# EAGLE design SD_Node (EAGLE 7.2.0)
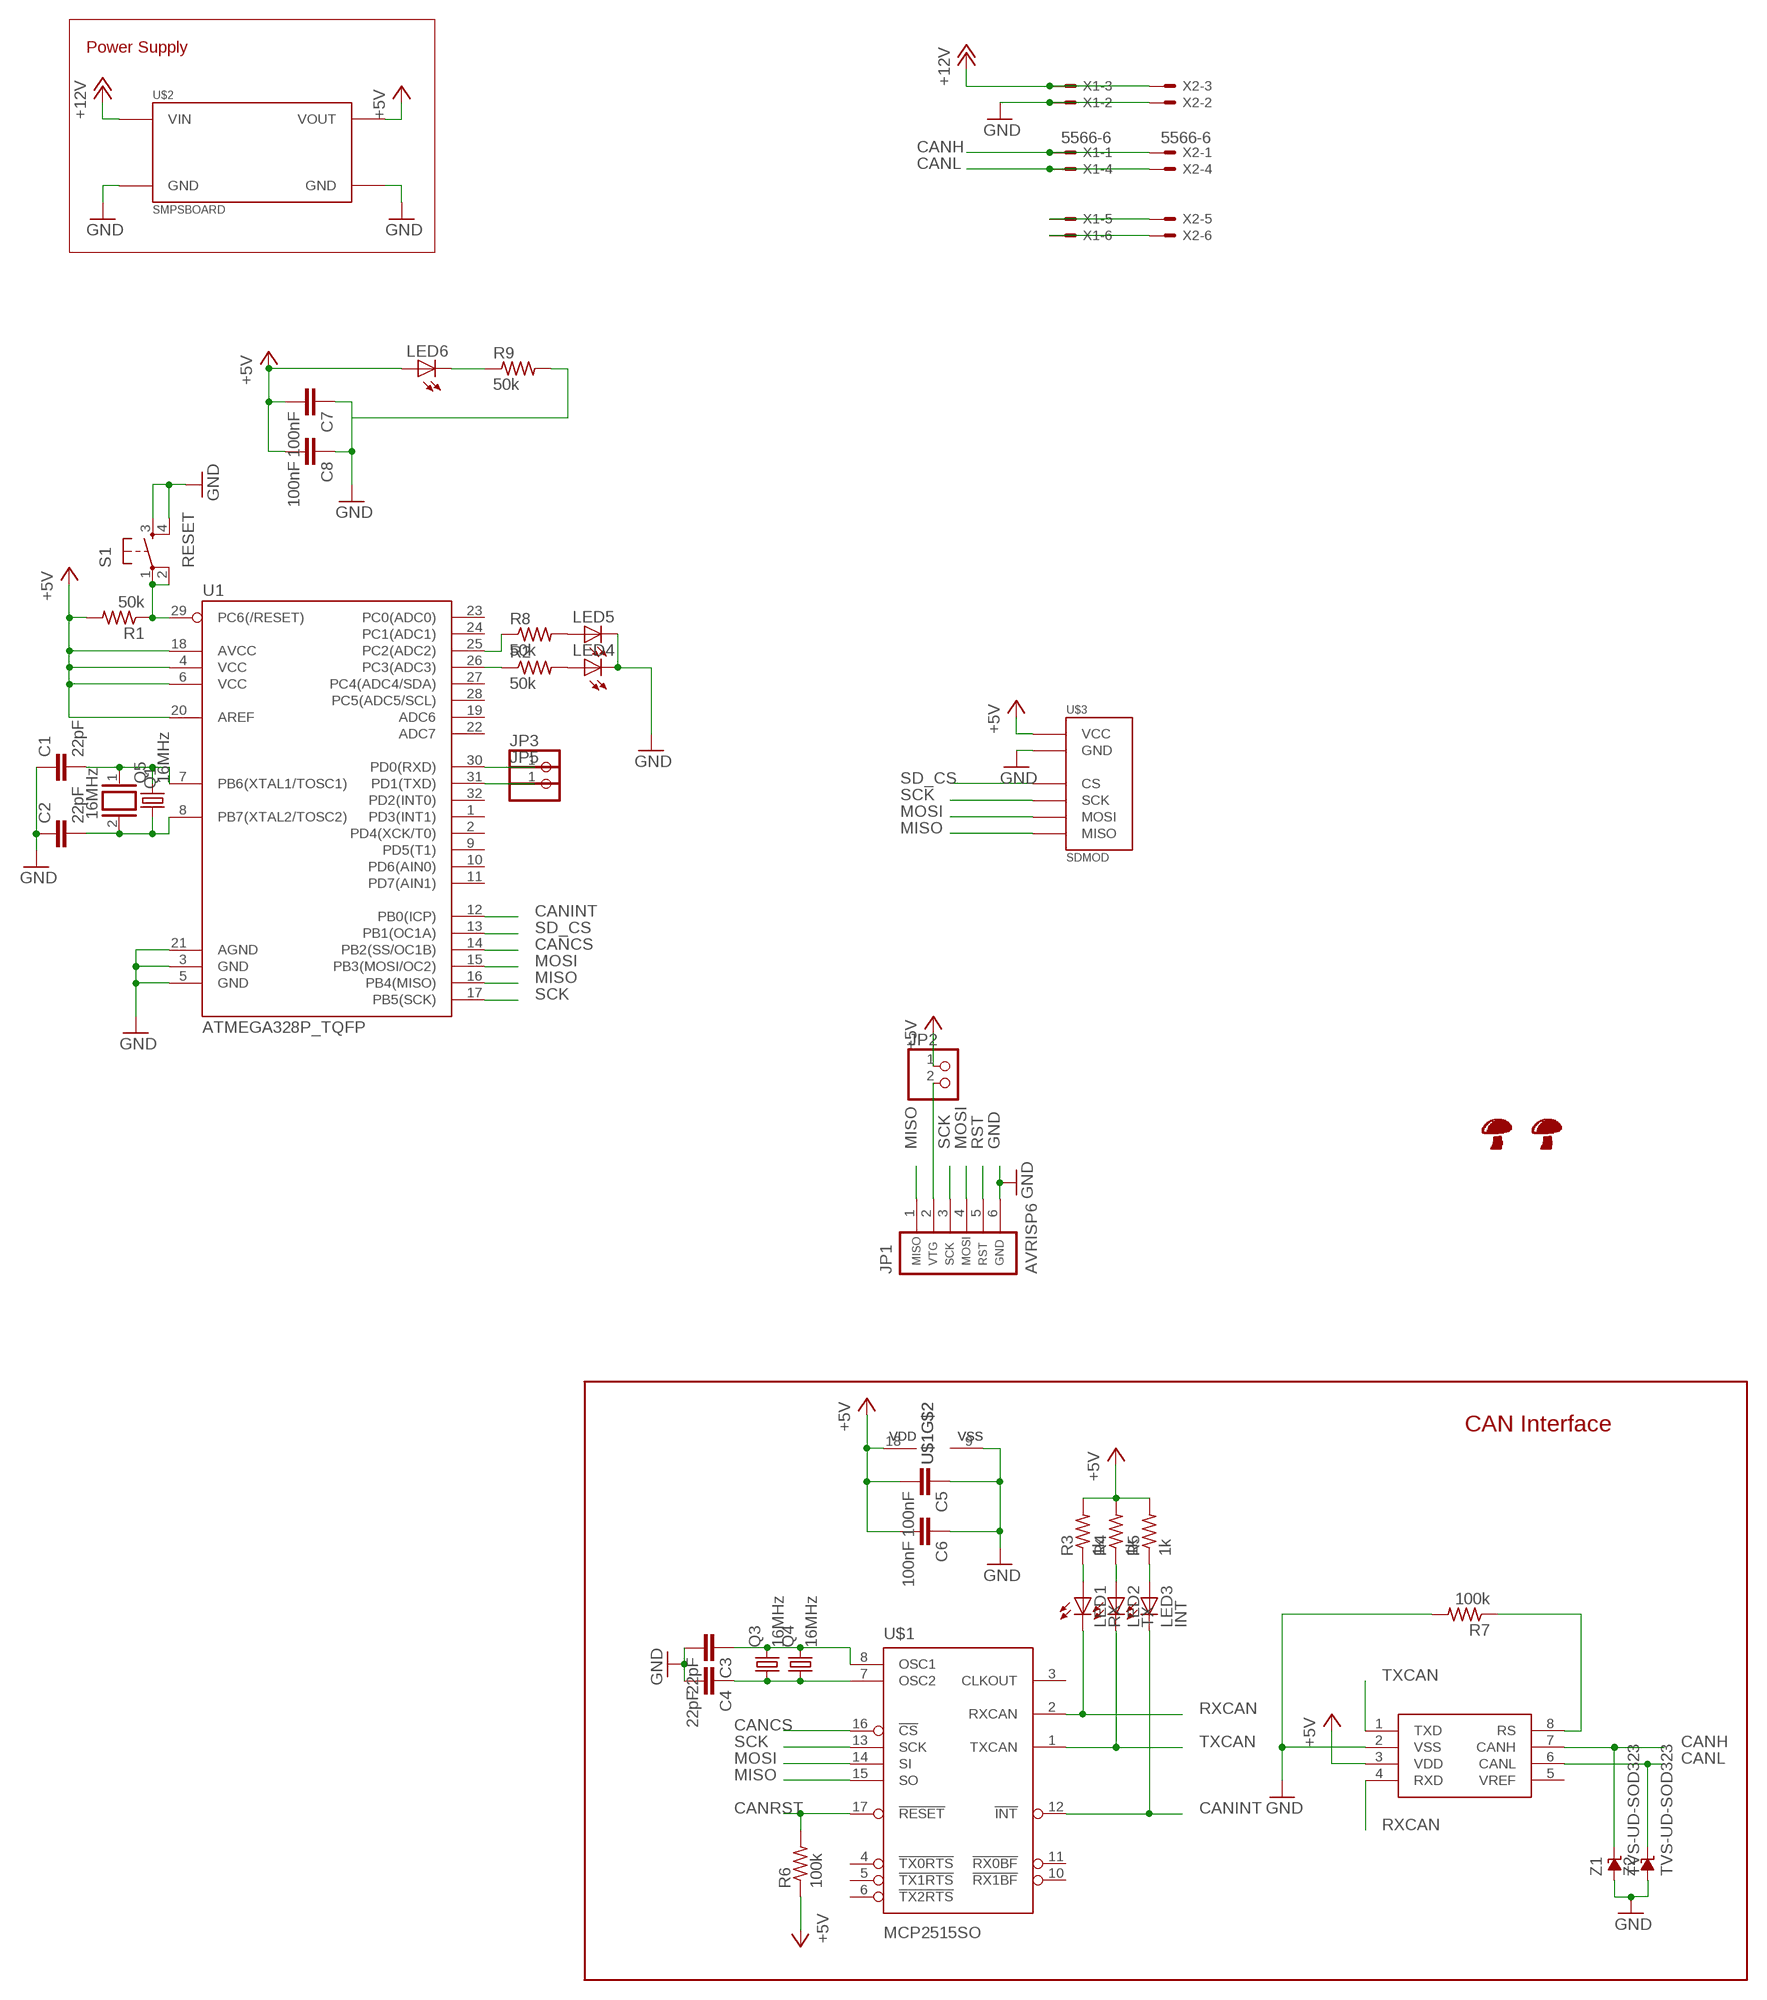
[diagram p0: schematic, sheet 1]

## Parts
C1  22pF  C-EUC0805  [C0805]
C2  22pF  C-EUC0805  [C0805]
C3  22pF  C-EUC0805K  [C0805K]
C4  22pF  C-EUC0805K  [C0805K]
C5  100nF  C-EUC0805K  [C0805K]
C6  100nF  C-EUC0805K  [C0805K]
C7  100nF  C-EUC0805  [C0805]
C8  100nF  C-EUC0805  [C0805]
JP1  AVRISP6  AVR-ISP6-75869-131  [HDR-75869-131]
JP2  PINHD-1X2  [1X02]
JP3  PINHD-1X1  [1X01]
JP5  PINHD-1X1  [1X01]
LED1  RX  LEDCHIP-LED0805  [CHIP-LED0805]
LED2  TX  LEDCHIP-LED0805  [CHIP-LED0805]
LED3  INT  LEDCHIP-LED0805  [CHIP-LED0805]
LED4  LEDCHIP-LED0805  [CHIP-LED0805]
LED5  LEDCHIP-LED0805  [CHIP-LED0805]
LED6  LEDCHIP-LED0805  [CHIP-LED0805]
Q1  16MHz  XTAL/S  [QS]
Q3  16MHz  CRYSTALHC49S  [HC49/S]
Q4  16MHz  CRYSTALHC49UP  [HC49UP]
Q5  16MHz  CRYSTALHC49UP  [HC49UP]
R1  50k  R-US_R0805  [R0805]
R2  50k  R-US_R0805  [R0805]
R3  1k  R-US_R0805  [R0805]
R4  1k  R-US_R0805  [R0805]
R5  1k  R-US_R0805  [R0805]
R6  100k  R-US_R0805  [R0805]
R7  100k  R-US_R0805  [R0805]
R8  50k  R-US_R0805  [R0805]
R9  50k  R-US_R0805  [R0805]
S1  RESET  TAC_SWITCHSMD  [TACTILE_SWITCH_SMD]
U1  ATMEGA328P_TQFP  [TQFP32-08]
U2  MCP2551  [SO08]
U$1  MCP2515SO  [SO-18W]
U$2  SMPSBOARD  [SMPSBOARD]
U$3  SDMOD  [SDMOD]
U$4  SHROOM15MM  [SHROOM15MM]
U$5  SHROOM5MM  [SHROOM]
X1  5566-6  [5566-6]
X2  5566-6  [5566-6]
Z1  TVS-UD-SOD323  [SOD323]
Z2  TVS-UD-SOD323  [SOD323]

## Nets
+5V: C5.2 C6.2 C7.2 C8.2 JP2.1 LED6.A R1.2 R3.2 R4.2 R5.2 R6.1 U1.4(VCC) U1.6(VCC) U1.18(AVCC) U1.20(AREF) U2.3(VDD) U$1.18(VDD) U$2.VOUT U$3.VCC
+12V: U$2.VIN X1.3 X2.3
CANCS: U1.14(PB2(SS/OC1B)) U$1.16(!CS)
CANH: U2.7(CANH) X1.1 X2.1 Z1.C
CANINT: LED3.C U1.12(PB0(ICP)) U$1.12(!INT)
CANL: U2.6(CANL) X1.4 X2.4 Z2.C
CANRST: R6.2 U$1.17(!RESET)
CANSTBY: R7.1 U2.8(RS)
GND: C1.1 C2.1 C3.2 C4.2 C5.1 C6.1 C7.1 C8.1 JP1.6 LED4.C LED5.C R7.2 R9.2 S1.3 S1.4 U1.3(GND) U1.5(GND) U1.21(AGND) U2.2(VSS) U$1.9(VSS) U$2.GND U$2.GND@(GND) U$3.GND X1.2 X2.2 Z1.A Z2.A
MISO: JP1.1 U1.16(PB4(MISO)) U$1.15(SO) U$3.MISO
MOSI: JP1.4 U1.15(PB3(MOSI/OC2)) U$1.14(SI) U$3.MOSI
N$1: C1.2 Q1.1 Q5.2 U1.7(PB6(XTAL1/TOSC1))
N$2: C2.2 Q1.2 Q5.1 U1.8(PB7(XTAL2/TOSC2))
N$3: C3.1 Q3.2 Q4.2 U$1.8(OSC1)
N$4: LED4.A R2.2
N$5: LED5.A R8.2
N$6: C4.1 Q3.1 Q4.1 U$1.7(OSC2)
N$7: LED1.A R3.1
N$8: LED2.A R4.1
N$9: LED3.A R5.1
N$10: JP1.2 JP2.2
N$11: R2.1 U1.26(PC3(ADC3))
N$12: R8.1 U1.25(PC2(ADC2))
N$13: LED6.C R9.1
N$14: X1.5 X2.5
N$15: X1.6 X2.6
N$16: JP3.1 U1.30(PD0(RXD))
N$17: JP5.1 U1.31(PD1(TXD))
RST: JP1.5 R1.1 S1.1 S1.2 U1.29(PC6(/RESET))
RXCAN: LED1.C U2.4(RXD) U$1.2(RXCAN)
SCK: JP1.3 U1.17(PB5(SCK)) U$1.13(SCK) U$3.SCK
SD_CS: U1.13(PB1(OC1A)) U$3.CS
TXCAN: LED2.C U2.1(TXD) U$1.1(TXCAN)
Unconnected: U1.1(PD3(INT1)) U1.2(PD4(XCK/T0)) U1.9(PD5(T1)) U1.10(PD6(AIN0)) U1.11(PD7(AIN1)) U1.19(ADC6) U1.22(ADC7) U1.23(PC0(ADC0)) U1.24(PC1(ADC1)) U1.27(PC4(ADC4/SDA)) U1.28(PC5(ADC5/SCL)) U1.32(PD2(INT0)) U2.5(VREF) U$1.3(CLKOUT) U$1.4(!TX0RTS) U$1.5(!TX1RTS) U$1.6(!TX2RTS) U$1.10(!RX1BF) U$1.11(!RX0BF)

## Notes on the sheet
- Power Supply
- CAN Interface

## Library data of the parts
C1-C8 = resistor:C-EU: CAPACITOR, European symbol
JP1 = atmel-avr:AVR-ISP6-: AVR ISP-6 Serial Programming Header
JP2 = pinhead:PINHD-1X2: PIN HEADER
JP3 JP5 = pinhead:PINHD-1X1: PIN HEADER
LED1-LED6 = led:LED: LED OSRAM: - CHIPLED LG R971, LG N971, LY N971, LG Q971, LY Q971, LO R971, LY R971 LH N974, LH R974 LS Q976, LO Q976, LY Q976 LO Q996 - Hyper CHIPLED LW Q18S LB Q993, LB Q99A, LB R99A - SideLED LS A670, LO A670, LY A670, LG A670, LP A670 LB A673, LV A673, LT A673, LW A673 LH A674 LY A675 LS A676, LA A676, LO A676, LY A676, LW A676 LS A679, LY A679, LG A679 - Hyper Micro SIDELED® LS Y876, LA Y876, LO Y876, LY Y876 LT Y87S - SmartLED LW L88C, LW L88S LB L89C, LB L89S, LG L890 LS L89K, LO L89K, LY L89K LS L896, LA L896, LO L896, LY L896 - TOPLED LS T670, LO T670, LY T670, LG T670, LP T670 LSG T670, LSP T670, LSY T670, LOP T670, LYG T670 LG T671, LOG T671, LSG T671 LB T673, LV T673, LT T673, LW T673 LH T674 LS T676, LA T676, LO T676, LY T676, LB T676, LH T676, LSB T676, LW T676 LB T67C, LV T67C, LT T67C, LS T67K, LO T67K, LY T67K, LW E67C LS E67B, LA E67B, LO E67B, LY E67B, LB E67C, LV E67C, LT E67C LW T67C LS T679, LY T679, LG T679 LS T770, LO T770, LY T770, LG T770, LP T770 LB T773, LV T773, LT T773, LW T773 LH T774 LS E675, LA E675, LY E675, LS T675 LS T776, LA T776, LO T776, LY T776, LB T776 LHGB T686 LT T68C, LB T68C - Hyper Mini TOPLED® LB M676 - Mini TOPLED Santana® LG M470 LS M47K, LO M47K, LY M47K Source: http://www.osram.convergy.de LUXEON: - LUMILED® LXK2-PW12-R00, LXK2-PW12-S00, LXK2-PW14-U00, LXK2-PW14-V00 LXK2-PM12-R00, LXK2-PM12-S00, LXK2-PM14-U00 LXK2-PE12-Q00, LXK2-PE12-R00, LXK2-PE12-S00, LXK2-PE14-T00, LXK2-PE14-U00 LXK2-PB12-K00, LXK2-PB12-L00, LXK2-PB12-M00, LXK2-PB14-N00, LXK2-PB14-P00, LXK2-PB14-Q00 LXK2-PR12-L00, LXK2-PR12-M00, LXK2-PR14-Q00, LXK2-PR14-R00 LXK2-PD12-Q00, LXK2-PD12-R00, LXK2-PD12-S00 LXK2-PH12-R00, LXK2-PH12-S00 LXK2-PL12-P00, LXK2-PL12-Q00, LXK2-PL12-R00 Source: www.luxeon.com KINGBRIGHT: KA-3528ASYC Source: www.kingbright.com
Q1 = special:XTAL/S: CRYSTAL
Q3 = crystal:CRYSTAL: CRYSTAL; OC_FARNELL: 1667008; OC_NEWARK: unknown
Q4 Q5 = crystal:CRYSTAL: CRYSTAL; OC_FARNELL: unknown; OC_NEWARK: unknown
R1-R9 = resistor:R-US_: RESISTOR, American symbol
S1 = SparkFun:TAC_SWITCH: Momentary Switch Button commonly used for reset or general input. Spark Fun Electronics SKU : COM-00097
U1 = SparkFun-DigitalIC:ATMEGA328P_TQFP; PROD_ID: IC-09069
U2 = SparkFun:MCP2551
U$1 = RobThePyro:MCP2515: MCP2515 CAN Controller by Microchip
U$2 = RobThePyro:SMPSBOARD
U$3 = RobThePyro:SDMOD: Micro sd card module
U$4 U$5 = RobThePyro:SHROOM
X1 X2 = con-molex:5566-6: Mini FIT connector 6 pol Source: http://www.molex.com; MPN: 95566-61002; OC_FARNELL: unknown; OC_NEWARK: 22K8620
Z1 Z2 = supressor:TVS-UD-: TVS UNI-DIRECTIONAL

## Board
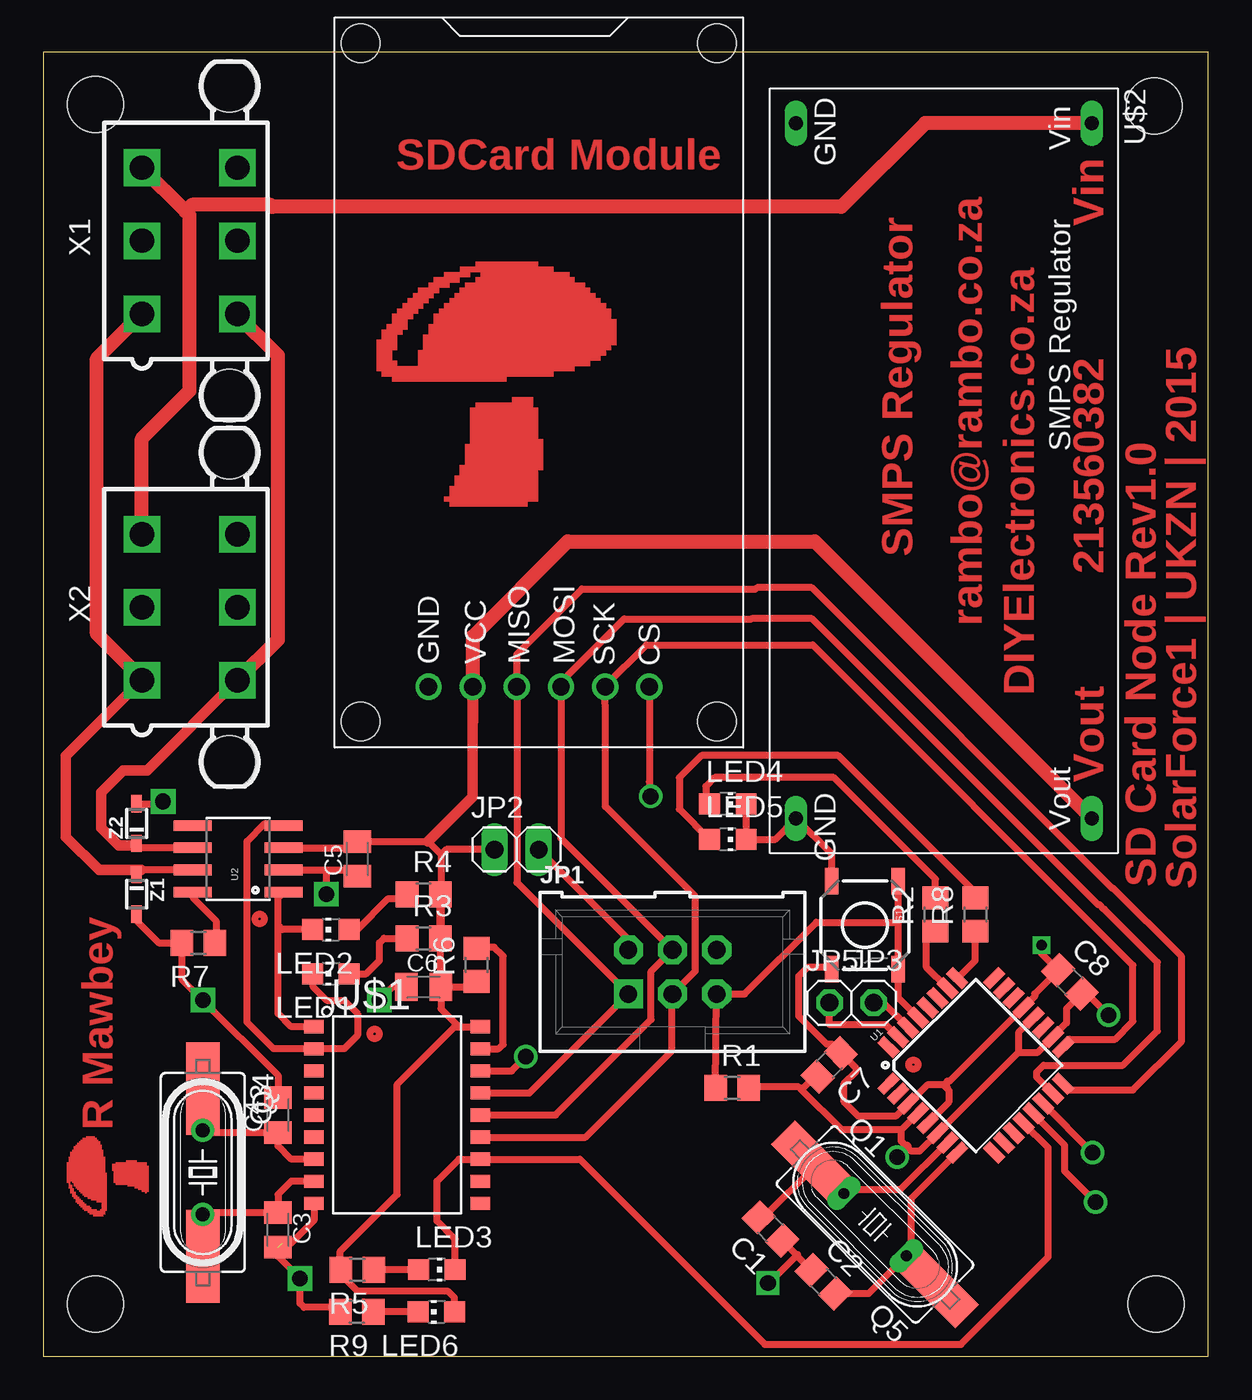
[diagram p1: board, top side]
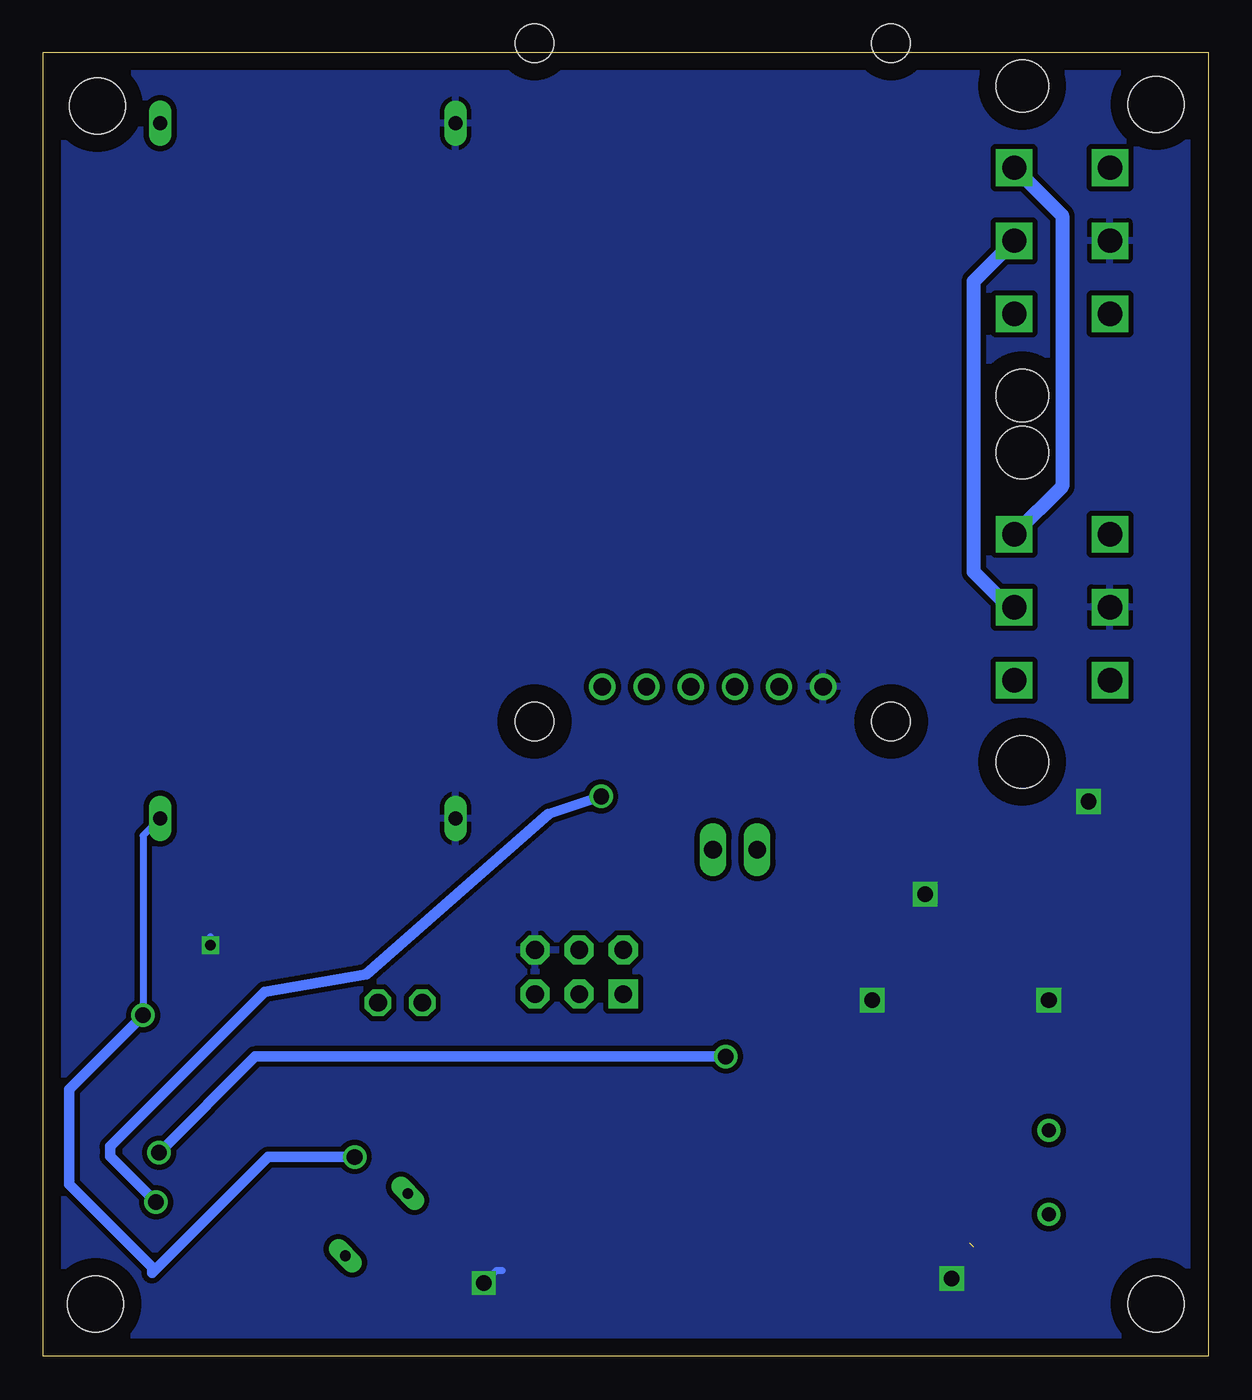
[diagram p2: board, bottom side, seen from below]

Size 67 x 75 mm. Coordinates in mm from the lower left corner, seen from the top.
Outline: 0,0 67,0 67,75 0,75 0,0
Copper layers (1*16): Top 0.035mm / dielectric 1.5mm / Bottom 0.035mm
Design rules "default": minimum track width 10mil, minimum drill 24mil, track to track 8mil, track to pad 8mil, pad to pad 8mil, via to via 8mil, smd to smd 8mil, copper to edge 40mil, drill to drill 8mil, minimum pad ring 10mil, minimum via ring 8mil, stop-mask expansion 4mil, vias tented up to drill 0mil, thermal gap 10mil
Holes 3.2 mm at 3,3 3,72 63.9,71.9 64,3

### Footprints (pad centres in the part's own frame; a part is rotated, then mirrored left to right if it is on the bottom)
C0805 = smd 1.3 x 1.5: 1 -0.95,0; 2 0.95,0
C0805K = smd 1.3 x 1.6: 1 -1,0; 2 1,0
HDR-75869-131 = drill 1.016 pad 1.676 square: 1 -2.54,-1.27 | drill 1.016 pad 1.676 octagon: 2 -2.54,1.27; 3 0,-1.27; 4 0,1.27; 5 2.54,-1.27; 6 2.54,1.27
1X02 = drill 1.016 long: 1 -1.27,0; 2 1.27,0
1X01 = drill 1.016 octagon: 1 0,0
CHIP-LED0805 = smd 1.2 x 1.2: A 0,-1.05; C 0,1.05
QS = drill 0.61 long: 1 -2.54,0; 2 2.54,0
HC49/S = drill 0.813: 1 -2.413,0; 2 2.413,0
HC49UP = smd 5.334 x 1.93: 1 -4.826,0; 2 4.826,0
R0805 = smd 1.3 x 1.5: 1 -0.95,0; 2 0.95,0
TACTILE_SWITCH_SMD = smd 1.524 x 0.762: 1 -2.54,1.905; 2 2.54,1.905; 3 -2.54,-1.905; 4 2.54,-1.905
TQFP32-08 = smd 1.27 x 0.559: 1 -4.293,2.8; 2 -4.293,2; 3 -4.293,1.2; 4 -4.293,0.4; 5 -4.293,-0.4; 6 -4.293,-1.2; 7 -4.293,-2; 8 -4.293,-2.8; 17 4.293,-2.8; 18 4.293,-2; 19 4.293,-1.2; 20 4.293,-0.4; 21 4.293,0.4; 22 4.293,1.2; 23 4.293,2; 24 4.293,2.8 | smd 0.559 x 1.27: 9 -2.8,-4.293; 10 -2,-4.293; 11 -1.2,-4.293; 12 -0.4,-4.293; 13 0.4,-4.293; 14 1.2,-4.293; 15 2,-4.293; 16 2.8,-4.293; 25 2.8,4.293; 26 2,4.293; 27 1.2,4.293; 28 0.4,4.293; 29 -0.4,4.293; 30 -1.2,4.293; 31 -2,4.293; 32 -2.8,4.293
SO08 = smd 0.61 x 2.21: 1 -1.905,-2.616; 2 -0.635,-2.616; 3 0.635,-2.616; 4 1.905,-2.616; 5 1.905,2.616; 6 0.635,2.616; 7 -0.635,2.616; 8 -1.905,2.616
SO-18W = smd 0.762 x 1.143: 1 -5.08,-4.788; 2 -3.81,-4.788; 3 -2.54,-4.788; 4 -1.27,-4.788; 5 0,-4.788; 6 1.27,-4.788; 7 2.54,-4.788; 8 3.81,-4.788; 9 5.08,-4.788; 10 5.08,4.788; 11 3.81,4.788; 12 2.54,4.788; 13 1.27,4.788; 14 0,4.788; 15 -1.27,4.788; 16 -2.54,4.788; 17 -3.81,4.788; 18 -5.08,4.788
SMPSBOARD = drill 0.8 long: GND 2,1.5; GND@ 42,1.5; VIN 2,18.5; VOUT 42,18.5
SDMOD = drill 1: CS 3.5,5.4; GND 3.5,18.1; MISO 3.5,13.02; MOSI 3.5,10.48; SCK 3.5,7.94; VCC 3.5,15.56 | hole 2.2: 1.5,1.5; 1.5,22; 40.5,22; 40.5,1.5
5566-6 = drill 1.4 square: 1 4.2,-2.75; 2 0,-2.75; 3 -4.2,-2.75; 4 4.2,2.75; 5 0,2.75; 6 -4.2,2.75 | hole 3: 8.9,2.29; -8.9,2.29
SOD323 = smd 1 x 0.6: A 1.143,0; C -1.143,0

### Placement (x,y rotation side)
C1  41.82,7.31 135 top
C2  44.86,4.27 315 top
C3  13.49,7.26 270 top
C4  13.49,13.86 90 top
C5  18.06,28.59 90 top
C6  21.87,21.23 0 top
C7  45.2,16.75 225 top
C8  59.04,21.51 315 top
JP1  36.19,22.09 0 top
JP2  27.22,29.13 0 top
JP3  47.75,20.32 0 top
JP5  45.21,20.32 0 top
LED1  16.53,21.99 90 top
LED2  16.53,24.53 90 top
LED3  22.63,4.97 270 top
LED4  39.37,31.75 270 top
LED5  39.37,29.72 270 top
LED6  22.61,2.54 90 top
Q1  47.84,7.56 315 top
Q3  9.17,10.56 270 top
Q4  9.17,10.56 270 top
Q5  47.83,7.57 135 top
R1  39.62,15.41 0 top
R2  51.31,25.4 90 top
R3  21.87,24.02 0 top
R4  21.87,26.56 0 top
R5  18.06,4.97 180 top
R6  24.92,22.5 90 top
R7  8.91,23.77 180 top
R8  53.59,25.4 90 top
R9  18.03,2.54 180 top
S1  47.25,24.78 270 top
U1  53.62,16.72 45 top
U2  11.2,28.59 90 top
U$1  20.34,13.86 270 top
U$2  41.8,72.92 270 top
U$3  40.25,35 90 top
U$4  19,49 0 top
U$5  6,8 90 top
X1  8.41,64.15 270 top
X2  8.41,43.07 270 top
Z1  5.36,26.56 270 top
Z2  5.36,30.63 90 top

### Tracks (layer width: path | path; a pad name or v marks a point on that pad's centre or on a via)
+5V  (via drill 0.9)
  Top 0.406: U2.3 17.69,29.23 C5.2 22.14,29.59 22.88,28.85 | 22.88,28.85 22.88,24.6 R4.2 R3.2 22.82,21.28 C6.2 | 23.9,18.94 23.65,18.94 20.34,15.64 20.34,9.29 17.04,5.99 17.04,5.46 | 23.9,18.94 U$1.18 | C6.2 22.87,19.97 23.9,18.94 | C6.2 24.6,21.23 R6.1 | 17.04,5.46 17.04,5.04 | 17.04,5.04 R5.2 17.11,4.67 18.03,3.75 23.24,3.75 23.62,3.37 23.62,2.57 LED6.A | 17.17,5.34 17.04,5.46 | JP2.1 23.17,29.13 22.88,28.85 | 49.35,13.01 49.35,12.35 49.92,11.78 50.4,11.78 51.44,12.81 U1.6 56.08,17.48 | 49.35,13.01 U1.4 | 49.35,13.01 45.92,13.01 43.6,15.32 | 43.6,15.32 43.45,15.47 40.63,15.47 R1.2 | C7.2 44.35,16.08 43.6,15.32 | 56.08,17.48 57.2,17.48 U1.18 58.07,18.37 58.85,19.15 58.85,19.98 C8.2 60.03,20.84 v61.27,19.6 | U1.20 56.08,18.61 56.08,17.48 | 17.04,5.04 17.02,5.01
  Top 0.61: 22.14,29.59 24.69,32.15 U$3.VCC 24.7,36.51 24.7,38.85 | v49.1,11.45 49.65,12 49.65,12.03 49.58,11.95 49.55,11.95
  Top 0.813: 24.7,38.85 24.7,41.4 30.15,46.85 44.36,46.85 U$2.VOUT
  Bottom 0.406: U$2.VOUT 61.27,29.94 v61.27,19.6
  Bottom 0.61: v61.27,19.6 65.53,15.35 65.53,9.88 60.75,5.1 60.75,4.78 54.08,11.45 v49.1,11.45
+12V
  Top 0.813: X2.3 5.66,52.77 8.41,55.52 8.41,65.6 8.17,65.84 | 8.17,65.84 X1.3 5.61,68.4 | U$2.VIN 50.72,70.92 45.9,66.1 13.18,66.1 13.05,66.22 8.55,66.22 8.17,65.84
CANCS  (via drill 0.9)
  Top 0.406: U$1.16 26.93,16.4 v27.75,17.23 | v60.35,11.7 60.34,11.7 U1.14
  Bottom 0.61: v27.75,17.23 54.83,17.23 v60.35,11.7
CANH
  Top 0.406: U2.7 5.61,27.96 Z1.C
  Top 0.61: 5.61,27.96 3.2,27.96 1.29,29.86 1.29,34.51 X2.1
  Top 0.813: X2.1 5.66,38.96 3.07,41.55 3.07,57.37 X1.1
CANINT
  Top 0.406: LED3.C 23.68,6.72 22.63,7.77 22.63,10.05 23.9,11.32 U$1.12 30.85,11.32 41.5,0.68 52.77,0.68 57.8,5.7 57.8,11.98 U1.12
CANL
  Top 0.406: U2.6 5.61,29.23 Z2.C
  Top 0.61: X2.4 5.96,33.67 4.6,33.67 3.33,32.4 3.33,30.37 4.34,29.36 5.23,29.36 Z2.C
  Top 0.813: X2.4 13.49,41.2 13.49,57.55 11.16,59.88 X1.4
CANRST
  Top 0.406: U$1.17 26.19,17.67 26.44,17.93 26.44,23.01 25.93,23.51 24.98,23.51 R6.2
CANSTBY
  Top 0.406: U2.8 8.58,26.38 9.93,25.04 9.93,23.83 R7.1
GND  (via drill 0.6, 0.9, 0.9 pad 1.42)  (1 unrouted)
  Top 0.406: U2.2 16.28,27.96 | 16.28,27.96 17.69,27.96 C5.1 | U$1.9 15.56,7.8 14.25,6.5 13.72,6.5 | Z1.A 5.36,25.04 6.63,23.77 R7.2 7.96,21.67 v9.17,20.47 13.49,16.15 C4.2 | C6.1 20.09,21.23 v19.33,20.47 | v16.28,26.56 16.28,27.96 | Z2.A 6.75,31.77 v6.88,31.9 | C3.2 13.49,5.73 v14.76,4.46 14.76,3.02 14.99,2.79 16.83,2.79 R9.2 | C2.1 C1.1 43.31,5.83 43.38,5.83 41.75,4.2 v41.67,4.2 | S1.3 45.35,28.87 U$2.GND@ 42.09,29.72 LED5.C LED4.C | 51.98,15.4 51.75,15.62 50.88,15.62 49.78,14.53 U1.3 49.74,14.52 49.02,13.8 46.88,13.8 46.05,14.62 46.05,15.68 46.75,16.38 46.75,16.54 C7.1 45.35,17.95 45.05,17.95 43.43,19.56 43.43,21.84 43.94,22.35 45.23,22.35 S1.4 | U1.5 52.08,14.6 52.08,15.3 51.98,15.4 | 51.98,15.4 51.98,15.82 52,15.8 52.1,15.8 56.34,20.04 U1.21 57.02,20.68 57.02,20.84 C8.1 57.4,23.15 v57.4,23.62
  Bottom 0.406: v41.67,4.2 40.95,4.92 40.6,4.92 | v57.4,23.62 57.4,24.13
  pour Bottom (isolate 0.305): 0,0 67,0 67,75 0,75
MISO
  Top 0.406: U$1.15 27.95,15.13 JP1.1 27.23,27.24 U$3.MISO 27.23,40.38 30.98,44.12 40.98,44.12 41.05,44.2 44.2,44.2 61.47,26.93 61.52,26.93 65.47,22.98 65.47,18.1 62.67,15.3 59,15.3 U1.16
MOSI
  Top 0.406: U$1.14 29.46,13.86 34.95,19.35 34.95,22.13 JP1.4 29.77,29.78 U$3.MOSI 29.77,38.77 33.4,42.4 40.73,42.4 40.74,42.42 44.2,42.42 60.66,25.95 60.75,25.95 61,25.7 61.02,25.7 64.08,22.65 64.08,18.7 62.1,16.73 57.52,16.73 57.12,16.32 57.12,16.05 U1.15
N$1
  Top 0.406: U1.7 49.27,9.55 46.24,9.55 Q1.1 Q5.2 41.42,7.98 C1.2
N$2
  Top 0.406: Q5.1 50.01,5.39 | 50.01,5.39 Q1.2 47.47,3.6 C2.2 | U1.8 52.55,11.7 49.9,9.05 49.9,5.5 50.01,5.39
N$3
  Top 0.406: Q4.2 Q3.2 9.17,8.26 C3.1 13.49,9.29 14.25,10.05 U$1.8
N$4
  Top 0.406: R2.2 51.31,27.43 45.47,33.27 38.61,33.27 38.1,32.77 38.1,31.97 LED4.A
N$5
  Top 0.406: R8.2 53.59,26.67 45.72,34.54 37.85,34.54 36.58,33.27 36.58,31.46 LED5.A
N$6
  Top 0.406: Q4.1 Q3.1 9.17,12.86 C4.1 13.49,12.08 14.25,11.32 U$1.7
N$7
  Top 0.406: LED1.A 18.57,21.99 19.33,22.75 19.33,23.77 19.58,24.02 R3.1
N$8
  Top 0.406: LED2.A 18.06,24.53 19.84,26.31 20.66,26.31 R4.1
N$9
  Top 0.406: LED3.A R5.1
N$10
  Top 0.406: JP1.2 33.65,23.97 JP2.2
N$11
  Top 0.406: U1.26 51.99,21.17 50.8,22.35 50.8,23.94 R2.1
N$12
  Top 0.406: U1.25 53.59,22.76 R8.1
N$13
  Top 0.406: LED6.C R9.1
N$14
  Bottom 0.813: X2.5 11.45,43.07 13.49,45.1 13.49,61.82 X1.5
N$15
  Bottom 0.813: X1.6 8.41,65.6 8.41,50.02 X2.6
N$16
  Top 0.406: U1.30 48.32,20.32 JP3.1
N$17
  Top 0.406: U1.31 48.46,19.05 45.21,19.05 JP5.1
RST
  Top 0.406: R1.1 38.71,20.81 JP1.5 40.33,20.82 44.45,24.95 49.16,24.95 | S1.1 49.16,24.95 | 49.16,24.95 S1.2 49.16,20.62 U1.29
RXCAN
  Top 0.406: LED1.C 15.48,21.26 16.28,20.47 17.3,20.47 18.06,19.7 18.06,18.43 17.3,17.67 U$1.2 13.23,17.67 11.71,19.2 11.71,29.61 12.72,30.63 13.69,30.63 U2.4
SCK
  Top 0.406: U$1.13 31.19,12.59 36.15,17.55 36.15,20.79 JP1.3 36.19,20.84 37.5,22.15 37.5,26.43 32.33,31.6 32.33,36.48 U$3.SCK 32.31,38.53 34.67,40.9 44.25,40.9 62.67,22.48 62.67,19.25 61.65,18.23 59.02,18.23 58.64,17.84 U1.17
SD_CS  (via drill 0.9)
  Top 0.406: U$3.CS 34.85,33.02 v34.92,32.19 | v60.52,8.85 58.75,10.62 58.75,12.12 56.94,13.93 U1.13
  Bottom 0.61: v34.92,32.19 37.95,31.18 48.43,21.97 54.27,20.95 63.17,12.05 63.17,11.5 v60.52,8.85
TXCAN
  Top 0.406: U$1.1 14.25,18.94 13.49,19.7 13.49,24.78 | 13.49,24.78 13.49,26.36 U2.1 | LED2.C 13.74,24.53 13.49,24.78
(copper drawn outside any net)
  shapes: Top circle x3

### Text on the board
Top: SDCard Module | Vin | SMPS Regulator | 213560382 | rambo@rambo.co.za | DIYElectronics.co.za | Vout | SD Card Node Rev1.0 | SolarForce1 | UKZN | 2015 | R Mawbey